# Altium project air.PrjPcb
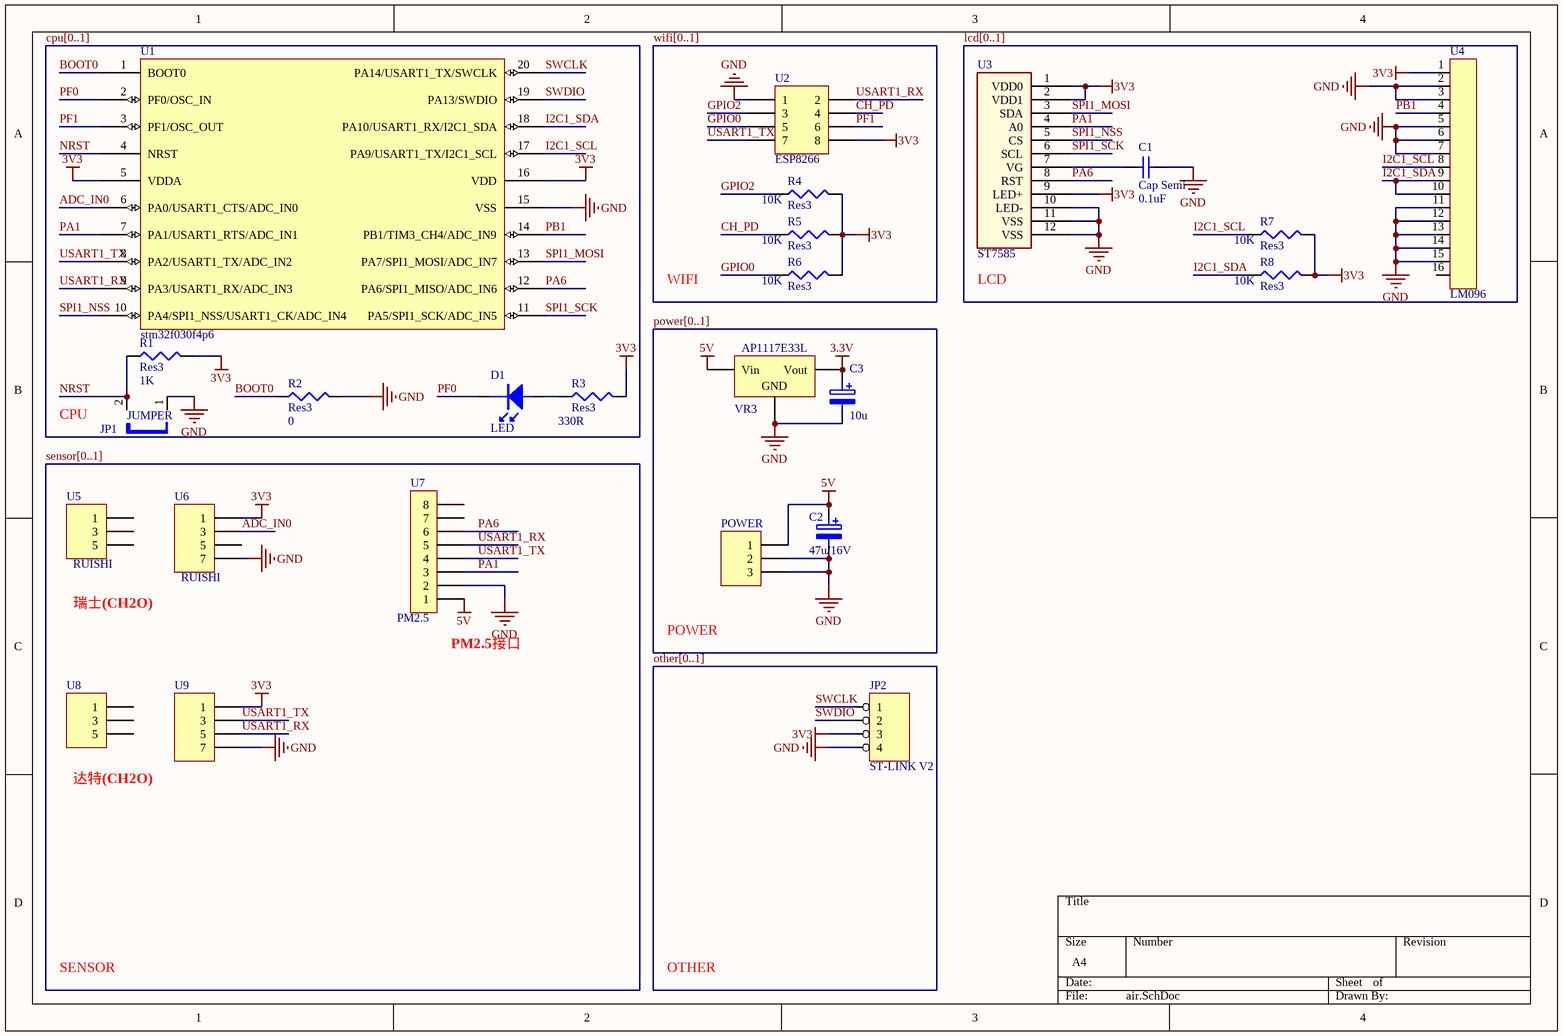
[diagram p0: air.SchDoc]
1 sheet, 25 parts. Net scope: global (net labels, ports and power ports of the same name join across sheets).
Board files: air.PcbDoc, air1.PcbDoc

## Sheet air.SchDoc
size A4

### Parts
C1  Cap Semi  value 0.1uF  [LC-0603_C]
C2  47u/16V  [LC-CASE-B_3528]
C3  10u  [LC-CASE-B_3528]
D1  LED  [LC-0603_LED_S1]
JP1  JUMPER  [HDR1X2]
JP2  ST-LINK V2  [HDR1x4]
POWER  Header 3  [POWER-B]  (value not drawn)
R1  Res3  value 1K  [LC-0603_R]
R2  Res3  value 0  [LC-0603_R]
R3  Res3  value 330R  [LC-0603_R]
R4  Res3  value 10K  [LC-0603_R]
R5  Res3  value 10K  [LC-0603_R]
R6  Res3  value 10K  [LC-0603_R]
R7  Res3  value 10K  [LC-0603_R]
R8  Res3  value 10K  [LC-0603_R]
U1  stm32f030f4p6  [LC-TSSOP-20]
U2  ESP8266  [HDR2X4]
U3  ST7585  [ST7585]
U4  LM096  [IDC16]
U5  RUISHI  [HDR2X3]
U6  RUISHI  [HDR2X4]
U7  PM2.5  [MHDR1x8]
U8  (no value)  [HDR2X3]
U9  Header 4  [HDR2X4]  (value not drawn)
VR3  AP1117E33L  [LC-SOT-223]

### Nets
3.3V: C3.1 VR3.2(Vout)
3V3: JP2.3 R1.2 R3.2 R4.2 R5.2 R6.2 R7.2 R8.2 U1.5(VDDA) U1.16(VDD) U2.8 U3.1(VDD0) U3.2(VDD1) U3.9(LED+) U4.1 U6.1 U9.1
5V: C2.1 POWER.1 U7.1 VR3.3(Vin)
GND: C1.2 C2.2 C3.2 JP1.1 JP2.4 POWER.2 POWER.3 R2.2 U1.15(VSS) U2.1 U3.10(LED-) U3.11(VSS) U3.12(VSS) U4.2 U4.3 U4.5 U4.6 U4.7 U4.11 U4.12 U4.13 U4.14 U4.15 U6.7 U7.2 U9.7 VR3.1(GND)
ADC_IN0: U1.6(PA0/USART1_CTS/ADC_IN0) U6.3
BOOT0: R2.1 U1.1(BOOT0)
CH_PD: R5.1 U2.4
GPIO0: R6.1 U2.5
GPIO2: R4.1 U2.3
I2C1_SCL: R7.1 U1.17(PA9/USART1_TX/I2C1_SCL) U4.8
I2C1_SDA: R8.1 U1.18(PA10/USART1_RX/I2C1_SDA) U4.9 U4.10
NRST: JP1.2 R1.1 U1.4(NRST)
PA1: U1.7(PA1/USART1_RTS/ADC_IN1) U3.4(A0) U7.3
PA6: U1.12(PA6/SPI1_MISO/ADC_IN6) U3.8(RST) U7.6
PB1: U1.14(PB1/TIM3_CH4/ADC_IN9) U4.4
PF0: D1.K U1.2(PF0/OSC_IN)
PF1: U1.3(PF1/OSC_OUT) U2.6
SPI1_MOSI: U1.13(PA7/SPI1_MOSI/ADC_IN7) U3.3(SDA)
SPI1_NSS: U1.10(PA4/SPI1_NSS/USART1_CK/ADC_IN4) U3.5(CS)
SPI1_SCK: U1.11(PA5/SPI1_SCK/ADC_IN5) U3.6(SCL)
SWCLK: JP2.1 U1.20(PA14/USART1_TX/SWCLK)
SWDIO: JP2.2 U1.19(PA13/SWDIO)
USART1_RX: U1.9(PA3/USART1_RX/ADC_IN3) U2.2 U7.5 U9.5
USART1_TX: U1.8(PA2/USART1_TX/ADC_IN2) U2.7 U7.4 U9.3
NetC1_1: C1.1 U3.7(VG)
NetD1_A: D1.A R3.1

Not connected (* = marked no-connect by the designer): U4 16; U5 1 2 3 4 5 6; U6 2 4 5 6 8; U7 7 8; U8 1 2 3 4 5 6; U9 2 4 6 8

### Buses and harness runs
bus cpu[0..1]
bus lcd[0..1]
bus other[0..1]
bus power[0..1]
bus sensor[0..1]
bus wifi[0..1]

### Notes on the sheet
- WIFI
- (near U3) LCD
- (near JP1) CPU
- (near U5) 瑞士(CH2O)
- (near U7) PM2.5接口
- POWER
- (near U8) 达特(CH2O)
- SENSOR
- OTHER

### Library data of the parts
C1 = Cap Semi: Capacitor (Semiconductor SIM Model); Published: 8-Jun-2000; LatestRevisionDate: 17-Jul-2002; LatestRevisionNote: Re-released for DXP Platform.; PackageReference: C1206; Publisher: Altium Limited
C2 C3 = ELECTRO2
JP2 = 4 HEADER: 4 Pin Header
POWER = Header 3: Header, 3-Pin; LatestRevisionDate: 17-Jul-2002; LatestRevisionNote: Re-released for DXP Platform.; Publisher: Altium Limited
R1-R8 = Res3: Resistor; Published: 8-Jun-2000; LatestRevisionDate: 04-Mar-2005; LatestRevisionNote: PCB Footprint replaced.; PackageReference: J1-0603; Publisher: Altium Limited
U2 = Header 4X2: Header, 4-Pin, Dual row; LatestRevisionDate: 17-Jul-2002; LatestRevisionNote: Re-released for DXP Platform.; Publisher: Altium Limited
U4 = 16PIN
U5 U8 = Header 33: Header, 6-Pin; LatestRevisionDate: 17-Jul-2002; LatestRevisionNote: Re-released for DXP Platform.; Publisher: Altium Limited
U6 U9 = Header 44: Header, 8-Pin; LatestRevisionDate: 17-Jul-2002; LatestRevisionNote: Re-released for DXP Platform.; Publisher: Altium Limited
U7 = 8PIN: Connector
VR3 = Volt Reg: Voltage Regulator; Published: 24-Mar-1999; LatestRevisionDate: 17-Jul-2002; LatestRevisionNote: Re-released for DXP Platform.; Publisher: Altium Limited; Code_JEDEC: SMD-220